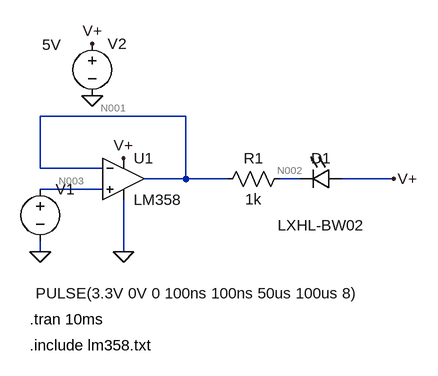
[diagram p0: schematic uart_led.asc]
uart_led.asc, the LTspice schematic file:
Version 4
SHEET 1 880 680
WIRE 240 64 16 64
WIRE 16 144 16 64
WIRE 112 144 16 144
WIRE 240 160 240 64
WIRE 240 160 176 160
WIRE 304 160 240 160
WIRE 416 160 384 160
WIRE 560 160 480 160
WIRE 112 176 16 176
WIRE 16 272 16 256
WIRE 144 272 144 192
FLAG 144 272 0
FLAG 16 272 0
FLAG 96 -48 V+
FLAG 96 32 0
FLAG 144 128 V+
FLAG 560 160 V+
SYMBOL Opamps\\opamp2 144 96 R0
SYMATTR InstName U1
SYMATTR Value LM358
SYMBOL voltage 16 160 R0
WINDOW 3 -7 176 Left 2
WINDOW 123 0 0 Left 2
WINDOW 39 0 0 Left 2
SYMATTR Value PULSE(3.3V 0V 0 100ns 100ns 50us 100us 8)
SYMATTR InstName V1
SYMBOL res 400 144 R90
WINDOW 0 0 56 VBottom 2
WINDOW 3 32 56 VTop 2
SYMATTR InstName R1
SYMATTR Value 1k
SYMBOL LED 480 144 R90
WINDOW 0 0 32 VBottom 2
WINDOW 3 72 32 VTop 2
SYMATTR InstName D1
SYMATTR Value LXHL-BW02
SYMBOL voltage 96 -64 R0
WINDOW 3 -77 18 Left 2
WINDOW 123 0 0 Left 2
WINDOW 39 0 0 Left 2
SYMATTR Value 5V
SYMATTR InstName V2
TEXT 0 416 Left 2 !.include lm358.txt
TEXT 0 376 Left 2 !.tran 10ms

The netlist it stands for:
* uart_led.asc
XU1 N003 N001 V+ 0 N001 LM358  ; pins In+ In- V+ V- OUT
V1 N003 0 PULSE(3.3V 0V 0 100ns 100ns 50us 100us 8)
R1 N002 N001 1k
D1 V+ N002 LXHL-BW02
V2 V+ 0 5V
.model D D
.lib standard.dio
.include lm358.txt
.tran 10ms
.backanno
.end

* Results of the author's LTspice run, read from the files saved beside the schematic
* Operating Point, zero values left out:
*   V(n001) = 3.3 V
*   V(v+) = 5 V
*   V(n003) = 3.3 V
*   V(n002) = 3.3 V
*   I(D1) = 4.294 nA
*   I(R1) = 4.294 nA
*   I(V2) = -175 µA
*   I(V1) = 19.83 nA
*   Ix(u1:1) = -19.83 nA
*   Ix(u1:2) = -19.89 nA
*   Ix(u1:3) = 175 µA
*   Ix(u1:4) = -174.9 µA
*   Ix(u1:5) = 24.18 nA
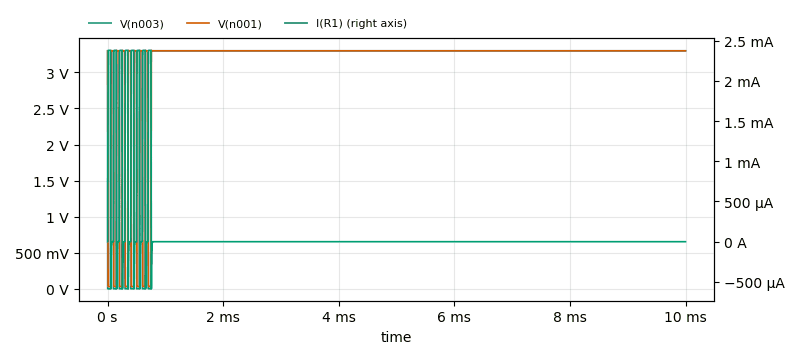
[diagram p1: Transient Analysis of uart_led.asc, plotted from the saved traces]
* Transient Analysis, 1 run:
*   V(n003): min 0 V, max 3.3 V, average 3.168 V, rms 3.233 V, last 3.3 V
*   V(n001): min 30.31 mV, max 3.306 V, average 3.167 V, rms 3.229 V, last 3.3 V
*   I(R1): min -585.5 µA, max 2.378 mA, average 92.24 µA, rms 465.6 µA, last 4.294 nA